# Altium schematic sheet usb.SchDoc: Control Plane
size Letter; Author: Ye-Sheng Kuo; Revision: 2; SheetNumber: 3; SheetTotal: 8
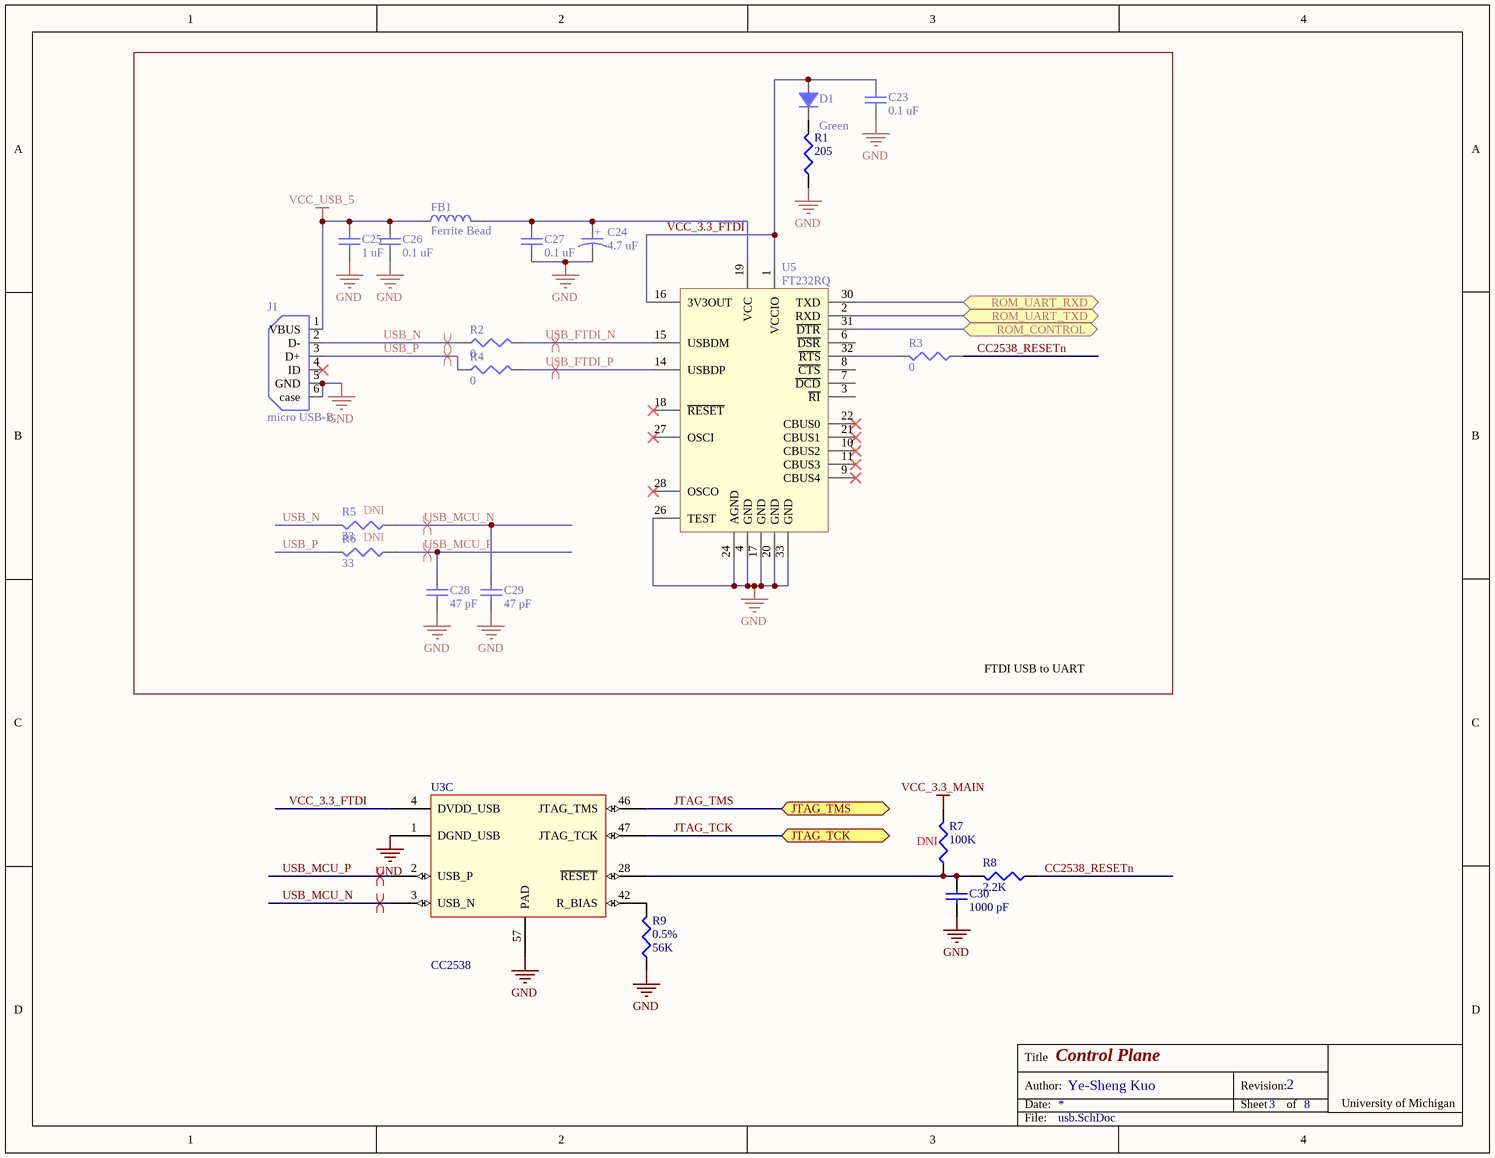
[diagram p0: usb.SchDoc]

## Parts
C23  value 0.1 uF  [0402]  (hidden comment: Ceramic capacitor)
C24  value 4.7 uF  [0603 - Polar Marking]  (hidden comment: Tantalum capacitor)
C25  value 1 uF  [0402]  (hidden comment: Ceramic capacitor)
C26  value 0.1 uF  [0402]  (hidden comment: Ceramic capacitor)
C27  value 0.1 uF  [0402]  (hidden comment: Ceramic capacitor)
C28  value 47 pF  [0402]  (hidden comment: Ceramic capacitor)
C29  value 47 pF  [0402]  (hidden comment: Ceramic capacitor)
C30  value 1000 pF  [0402]  (hidden comment: Ceramic capacitor)
D1  Color: Green  [0402 - DIODE]  (hidden comment: LED, Green)
FB1  Ferrite Bead  [0402]
J1  micro USB-B  [Micro USB-B]
R1  value 205  [0402]  (hidden comment: Chip resistor)
R2  value 0  [0402]  (hidden comment: Chip resistor)
R3  value 0  [0402]  (hidden comment: Chip resistor)
R4  value 0  [0402]  (hidden comment: Chip resistor)
R5  value 33  [0402]  (hidden comment: Chip resistor)
R6  value 33  [0402]  (hidden comment: Chip resistor)
R7  value 100K  [0402]  (hidden comment: Chip resistor)
R8  value 2.2K  [0402]  (hidden comment: Chip resistor)
R9  value 56K  tolerance: 0.5%  [0402]  (hidden comment: Chip resistor)
U3  CC2538  [QFN56]  (part C of 6)
U5  FT232RQ  [QFN-32]

## Ports
JTAG_TCK, JTAG_TMS, ROM_CONTROL, ROM_UART_RXD, ROM_UART_TXD

## Nets
GND: C23.2 C24.2 C25.2 C26.2 C27.2 C28.2 C29.2 C30.2 J1.5(GND) J1.6(case) R1.2 R9.2 U3.1(DGND_USB) U3.57(PAD) U5.4(GND) U5.17(GND) U5.20(GND) U5.24(AGND) U5.26(TEST) U5.33(GND)
VCC_3.3_MAIN: R7.1
VCC_USB_5: C25.1 C26.1 FB1.2 J1.1(VBUS)
CC2538_RESETn: R3.2 R8.2
JTAG_TCK: U3.47(JTAG_TCK) ; port JTAG_TCK
JTAG_TMS: U3.46(JTAG_TMS) ; port JTAG_TMS
ROM_CONTROL: U5.31(~{DTR}) ; port ROM_CONTROL
ROM_UART_RXD: U5.30(TXD) ; port ROM_UART_RXD
ROM_UART_TXD: U5.2(RXD) ; port ROM_UART_TXD
USB_FTDI_N: R2.1 U5.15(USBDM)
USB_FTDI_P: R4.1 U5.14(USBDP)
USB_MCU_N: C29.1 R5.2 U3.3(USB_N)
USB_MCU_P: C28.1 R6.2 U3.2(USB_P)
USB_N: J1.2(D-) R2.2 R5.1
USB_P: J1.3(D+) R4.2 R6.1
VCC_3.3_FTDI: C23.1 D1.1 U3.4(DVDD_USB) U5.1(VCCIO) U5.16(3V3OUT)
NetC24_1: C24.1 C27.1 FB1.1 U5.19(VCC)
NetC30_1: C30.1 R7.2 R8.1 U3.28(~{RESET})
NetD1_2: D1.2 R1.1
NetR3_1: R3.1 U5.32(~{RTS})
NetR9_1: R9.1 U3.42(R_BIAS)

Not connected (* = marked no-connect by the designer): J1 4(ID)*; U5 3(~{RI}) 6(~{DSR}) 7(~{DCD}) 8(~{CTS}) 9(CBUS4)* 10(CBUS2)* 11(CBUS3)* 18(~{RESET})* 21(CBUS1)* 22(CBUS0)* 27(OSCI)* 28(OSCO)*

## Layout directives
differential pair: USB_FTDI_N, USB_FTDI_P, USB_MCU_N, USB_MCU_P, USB_N, USB_P

## Notes on the sheet
- (near R5) DNI
- DNI
- FTDI USB to UART
- (near R7) DNI
- Title
- Date:
- Author:
- Revision:
- Sheet
- of
- University of Michigan
- File:
- (in symbol C_4.7u_10V_0603_tantalum) +

## Library data of the parts
C23 C26 C27 = C_0.1u_10V_0402_ceramic: Ceramic capacitor, 0.1u, 0402 package; Manufacture: TDK; voltage rated: 10 V; tolerance: 10%; Supplier 1: Digi-Key; Supplier Part Number 1: 445-1265-1-ND; package: 0402
C24 = C_4.7u_10V_0603_tantalum: Tantalum capacitor, 4.7 uF, 0603 package; Manufacture: Rohm; voltage rated: 10 V; tolerance: 20%; package: 0603; Supplier 1: Digi-Key; Supplier Part Number 1: 511-1496-1-ND
C25 = C_1u_16V_0402_ceramic: Ceramic capacitor, 1 uF, 16V, 0402 package; Manufacture: TDK; tolerance: 10%; Temperature rating: X5R; voltage rated: 16 V; package: 0402; Supplier 1: Digi-Key; Supplier Part Number 1: 445-4978-1-ND
C28 C29 = C_47p_0402_ceramic: Ceramic capacitor, 47 pF, 0402 package; Manufacture: Johanson; voltage rated: 50 V; tolerance: 5%; package: 0402; Supplier 1: Digi-Key; Supplier Part Number 1: 709-1121-1-ND
C30 = C_1000p_50V_0402_ceramic: Ceramic capacitor, 1000 pF, 0402 package; Manufacture: TDK; voltage rated: 50 V; tolerance: 10%; package: 0402; Supplier 1: Digi-Key; Supplier Part Number 1: 445-6846-1-ND
D1 = D_LED_GREEN_0402: LED, Green,  0402; package: 0402; Supplier 1: Digi-Key; Supplier Part Number 1: 511-1592-1-ND
FB1 = FB_150mA_0402: Ferrite Bead, 150 mA, 0402 package; impedance@Freq: 1K@100 MHz; current rating: 150 mA; Supplier 1: Digi-Key; Supplier Part Number 1: 587-1835-1-ND; package: 0402
J1 = Micro USB: CONN USB MICRO B RECPT SMT R/A; Supplier 1: Digi-Key; Supplier Part Number 1: 609-4616-6-ND
R1 = R_205_0402: Chip resistor, 205, 0402 package; tolerance: 1%; power: 1/16 W; package: 0402; Supplier 1: Digi-Key; Supplier Part Number 1: 541-205LCT-ND
R2-R4 = R_0_0402: Chip resistor, 0, 0402 package; package: 0402; Supplier 1: Digi-Key; Supplier Part Number 1: 541-0.0YBCT-ND
R5 R6 = R_33_0402: Chip resistor, 33, 0402 package; tolerance: 1%; power: 1/16 W; package: 0402; Supplier 1: Digi-Key; Supplier Part Number 1: 541-33.0LCT-ND
R7 = R_100K_0402: Chip resistor, 100K, 0402 package; tolerance: 1%; power: 1/16 W; Supplier 1: Digi-Key; Supplier Part Number 1: 541-100KLCT-ND; package: 0402
R8 = R_2.2K_0402: Chip resistor, 2.2K, 0402 package; tolerance: 1%; power: 1/16 W; package: 0402; Supplier 1: Digi-Key; Supplier Part Number 1: 541-2.20KLCT-ND
R9 = R_56K_0402: Chip resistor, 56K, 0402 package; power: 1/16 W; Temperature coefficient: 25 ppm/C; package: 0402; Supplier 1: Digi-Key; Supplier Part Number 1: P56KDECT-ND
U3 = CC2538: A Powerful System-On-Chip for 2.4-GHz IEEE 802.15.4, 6LoWPAN  and ZigBee Applications; Supplier 1: Digi-Key; Supplier Part Number 1: 296-35797-1-ND
U5 = FT232RQ: FT232R USB UART; Manufacturer: *; Note: *; ManufacturerPartNo: *; Supplier 1: Digi-Key; Supplier Part Number 1: 768-1008-1-ND